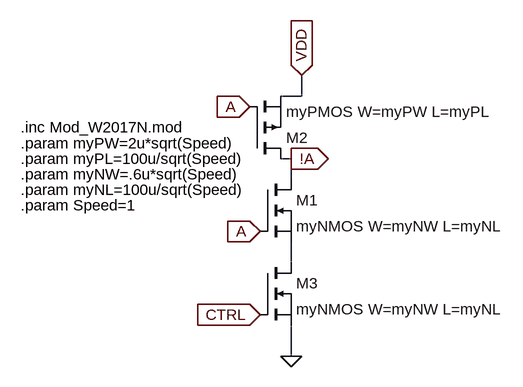
[diagram p0: schematic Gate_NOT_Starved_PARAM.asc]
Gate_NOT_Starved_PARAM.asc, the LTspice schematic file:
Version 4
SHEET 1 880 680
WIRE 64 -112 64 -144
WIRE 64 -112 32 -112
WIRE 48 -16 32 -16
WIRE 48 16 48 -16
WIRE 48 144 48 112
WIRE 48 288 48 240
FLAG 48 -16 !A
IOPIN 48 -16 Out
FLAG 64 -144 VDD
IOPIN 64 -144 In
FLAG 48 288 0
FLAG 0 96 A
IOPIN 0 96 In
FLAG -16 -96 A
IOPIN -16 -96 In
FLAG 0 224 CTRL
IOPIN 0 224 In
SYMBOL nmos 0 16 R0
SYMATTR InstName M1
SYMATTR Value myNMOS W=myNW L=myNL
SYMBOL pmos -16 -16 M180
SYMATTR InstName M2
SYMATTR Value myPMOS W=myPW L=myPL
SYMBOL nmos 0 144 R0
SYMATTR InstName M3
SYMATTR Value myNMOS W=myNW L=myNL
TEXT -368 -64 Left 2 !.inc Mod_W2017N.mod
TEXT -368 -40 Left 2 !.param myPW=2u*sqrt(Speed)
TEXT -368 -16 Left 2 !.param myPL=100u/sqrt(Speed)
TEXT -368 8 Left 2 !.param myNW=.6u*sqrt(Speed)
TEXT -368 32 Left 2 !.param myNL=100u/sqrt(Speed)
TEXT -368 56 Left 2 !.param Speed=1

The netlist it stands for:
* Gate_NOT_Starved_PARAM.asc
M1 !A A N001 N001 myNMOS W=myNW L=myNL
M2 !A A VDD VDD myPMOS W=myPW L=myPL
M3 N001 CTRL 0 0 myNMOS W=myNW L=myNL
.model NMOS NMOS
.model PMOS PMOS
.lib standard.mos
.inc Mod_W2017N.mod
.param myPW=2u*sqrt(Speed)
.param myPL=100u/sqrt(Speed)
.param myNW=.6u*sqrt(Speed)
.param myNL=100u/sqrt(Speed)
.param Speed=1
.backanno
.end